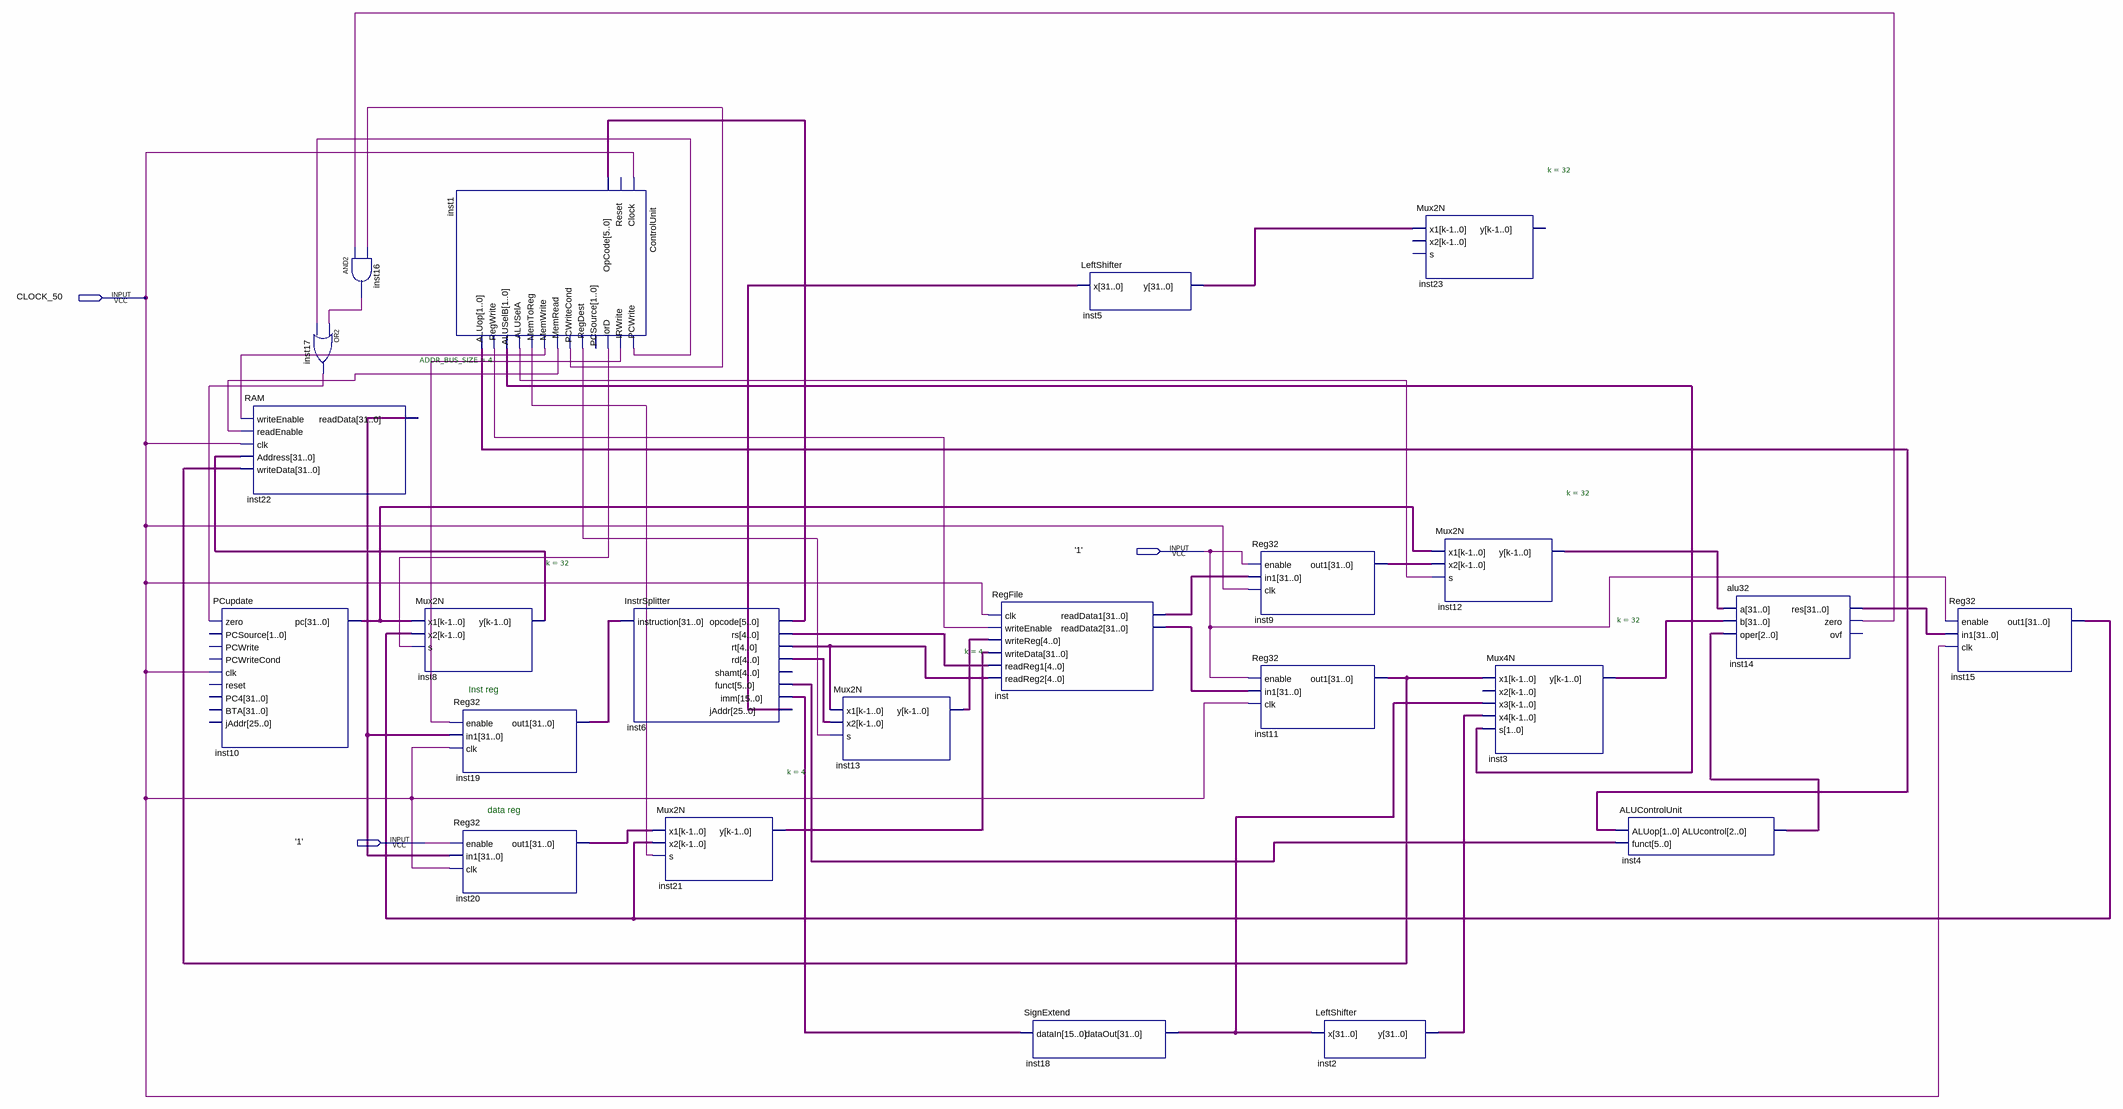
[diagram p0: schematic sheet]
// Quartus schematic multi_cycle.bdf as structural Verilog: 23 symbols, 3 pins
module multi_cycle (
  input  CLOCK_50,
  input  \'1' 
);

  wire inst1_alusela, inst1_iord, inst1_irwrite, inst1_memread, inst1_memtoreg, inst1_memwrite,
       inst1_pcwrite, inst1_pcwritecond, inst1_regdest, inst1_regwrite, inst14_zero, inst16_out, inst17_out;
  wire [1:0] inst1_aluop, inst1_aluselb;
  wire [2:0] inst4_alucontrol;
  wire [4:0] inst6_rd, inst6_rs, inst6_rt, inst13_y;
  wire [5:0] inst6_funct, inst6_opcode;
  wire [15:0] inst6_imm;
  wire [31:0] inst2_y, inst3_y, inst5_y, inst6_jaddr, inst8_y, inst9_out1, inst10_pc, inst11_out1, inst12_y,
       inst14_res, inst15_out1, inst18_dataout, inst19_out1, inst20_out1, inst21_y, inst22_readdata,
       inst_readdata1, inst_readdata2;

  PCupdate inst10 (
    .zero(inst17_out), .clk(CLOCK_50), .pc(inst10_pc));  // open: PCSource, PCWrite, PCWriteCond, reset, PC4, BTA, jAddr
  RAM #(.ADDR_BUS_SIZE(4)) inst22 (
    .writeEnable(inst1_memwrite), .readEnable(inst1_memread), .clk(CLOCK_50), .Address(inst8_y),
    .writeData(inst11_out1), .readData(inst22_readdata));
  or inst17 (inst17_out, inst16_out, inst1_pcwrite);
  and inst16 (inst16_out, inst14_zero, inst1_pcwritecond);
  Mux2N #(.k(32)) inst8 (.x1(inst10_pc), .x2(inst15_out1), .s(inst1_iord), .y(inst8_y));
  ControlUnit inst1 (
    .Clock(CLOCK_50), .OpCode(inst6_opcode), .PCWrite(inst1_pcwrite), .IRWrite(inst1_irwrite),
    .IorD(inst1_iord), .RegDest(inst1_regdest), .PCWriteCond(inst1_pcwritecond), .MemRead(inst1_memread),
    .MemWrite(inst1_memwrite), .MemToReg(inst1_memtoreg), .ALUSelA(inst1_alusela), .ALUSelB(inst1_aluselb),
    .RegWrite(inst1_regwrite), .ALUop(inst1_aluop));  // open: Reset, PCSource
  Reg32 inst19 (.enable(inst1_irwrite), .in1(inst22_readdata), .clk(CLOCK_50), .out1(inst19_out1));
  Reg32 inst20 (.enable(\'1' ), .in1(inst22_readdata), .clk(CLOCK_50), .out1(inst20_out1));
  InstrSplitter inst6 (
    .instruction(inst19_out1), .opcode(inst6_opcode), .rs(inst6_rs), .rt(inst6_rt), .rd(inst6_rd),
    .funct(inst6_funct), .imm(inst6_imm), .jAddr(inst6_jaddr));  // open: shamt
  Mux2N #(.k(4)) inst21 (.x1(inst20_out1), .x2(inst15_out1), .s(inst1_memtoreg), .y(inst21_y));
  Mux2N #(.k(4)) inst13 (.x1(inst6_rt), .x2(inst6_rd), .s(inst1_regdest), .y(inst13_y));
  RegFile inst (
    .clk(CLOCK_50), .writeEnable(inst1_regwrite), .writeReg(inst13_y), .writeData(inst21_y),
    .readReg1(inst6_rs), .readReg2(inst6_rt), .readData1(inst_readdata1), .readData2(inst_readdata2));
  SignExtend inst18 (.dataIn(inst6_imm), .dataOut(inst18_dataout));
  LeftShifter inst5 (.x(inst6_jaddr), .y(inst5_y));
  Reg32 inst9 (.enable(\'1' ), .in1(inst_readdata1), .clk(CLOCK_50), .out1(inst9_out1));
  Reg32 inst11 (.enable(\'1' ), .in1(inst_readdata2), .clk(CLOCK_50), .out1(inst11_out1));
  LeftShifter inst2 (.x(inst18_dataout), .y(inst2_y));
  Mux2N #(.k(32)) inst23 (.x1(inst5_y));  // open: x2, s, y
  Mux2N #(.k(32)) inst12 (.x1(inst10_pc), .x2(inst9_out1), .s(inst1_alusela), .y(inst12_y));
  Mux4N #(.k(32)) inst3 (
    .x1(inst11_out1), .x3(inst18_dataout), .x4(inst2_y), .s(inst1_aluselb), .y(inst3_y));  // open: x2
  ALUControlUnit inst4 (.ALUop(inst1_aluop), .funct(inst6_funct), .ALUcontrol(inst4_alucontrol));
  alu32 inst14 (.a(inst12_y), .b(inst3_y), .oper(inst4_alucontrol), .res(inst14_res), .zero(inst14_zero));  // open: ovf
  Reg32 inst15 (.enable(\'1' ), .in1(inst14_res), .clk(CLOCK_50), .out1(inst15_out1));

  // Notes on the sheet:
  //   Inst reg
  //   data reg
endmodule
